# Altium project Accelerometer.PrjPcb
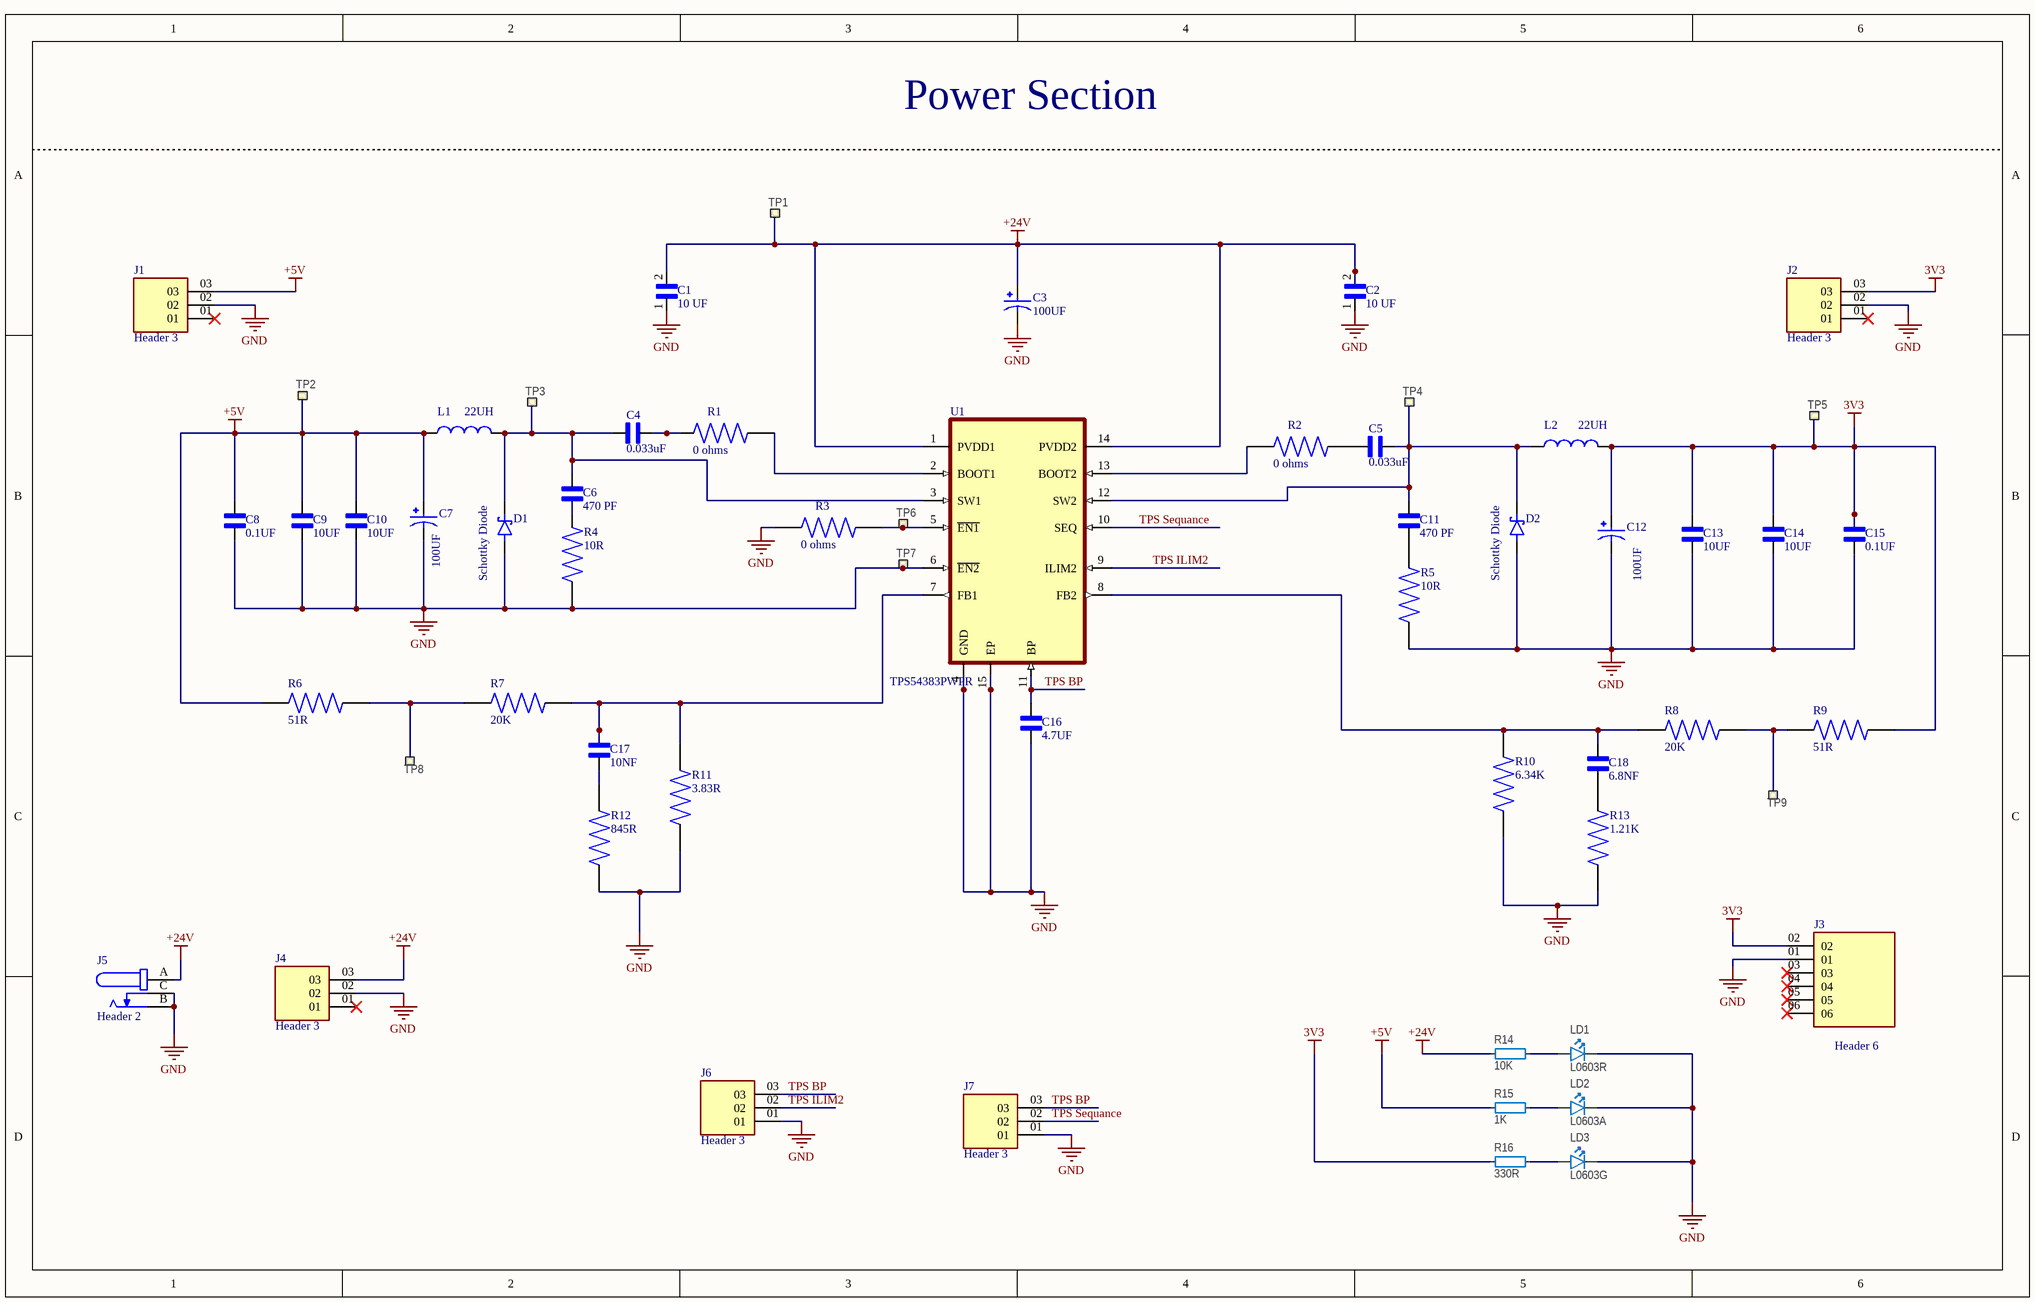
[diagram p0: Power section.SchDoc]
1 sheet, 58 parts. Net scope: global (net labels, ports and power ports of the same name join across sheets).
Board file: Accelero.PcbDoc

## Sheet Power section.SchDoc
size 381 x 241 mm; SheetNumber: 1; SheetTotal: 1

### Parts
C1  10 UF  [CAPC3216X180N]
C2  10 UF  [CAPC3216X180N]
C3  100UF  [CAP_EEEFC1E101P]
C4  0.033uF  [CAPC1608X90]
C5  0.033uF  [CAPC1608X90]
C6  470 PF  [CAPC1608X90]
C7  100UF  [CAP_EEEFC1E101P]
C8  0.1UF  [CAPC1608X90]
C9  10UF  [CAPC2012X140N]
C10  10UF  [CAPC2012X140N]
C11  470 PF  [CAPC1608X90]
C12  100UF  [CAP_EEEFC1E101P]
C13  10UF  [CAPC2012X140N]
C14  10UF  [CAPC2012X140N]
C15  0.1UF  [CAPC1608X90]
C16  4.7UF  [CAPC2012X140N]
C17  10NF  [CAPC1608X90]
C18  6.8NF  [CAPC1608X90]
D1  Schottky Diode  [DIOM7959X261N]
D2  Schottky Diode  [DIOM7959X261N]
J1  Header 3  [SAMTEC_HMTSW-103-XX-X-S-XXX]
J2  Header 3  [SAMTEC_HMTSW-103-XX-X-S-XXX]
J3  Header 6  [SAMTEC_MTLW-106-06-G-S-180]
J4  Header 3  [SAMTEC_HMTSW-103-XX-X-S-XXX]
J5  Header 2  [TENSILITY_54-00129]
J6  Header 3  [SAMTEC_HMTSW-103-XX-X-S-XXX]
J7  Header 3  [SAMTEC_HMTSW-103-XX-X-S-XXX]
L1  22UH  [IND_MSS1278-223MLB]
L2  22UH  [IND_MSS1278-223MLB]
LD1  L0603R  [LED_0603_R]
LD2  L0603A  [LED_0603_Y]
LD3  L0603G  [LED_0603_G]
R1  0 ohms  [RESC1608X55N]
R2  0 ohms  [RESC1608X55N]
R3  0 ohms  [RESC1608X55N]
R4  10R  [RESC1608X55N]
R5  10R  [RESC1608X55N]
R6  51R  [RESC1608X55N]
R7  20K  [RESC1608X55N]
R8  20K  [RESC1608X55N]
R9  51R  [RESC1608X55N]
R10  6.34K  [RESC1608X55N]
R11  3.83R  [RESC1608X55N]
R12  845R  [RESC1608X55N]
R13  1.21K  [RESC1608X55N]
R14  10K  [RESC0603X03L_C]
R15  1K  [RESC0603X03L_C]
R16  330R  [RESC0603X03L_C]
TP1  Ø0.7mm,SMD  [TP_SMD_D0.7mm]  (value not drawn)  (no BOM)
TP2  Ø0.7mm,SMD  [TP_SMD_D0.7mm]  (value not drawn)  (no BOM)
TP3  Ø0.7mm,SMD  [TP_SMD_D0.7mm]  (value not drawn)  (no BOM)
TP4  Ø0.7mm,SMD  [TP_SMD_D0.7mm]  (value not drawn)  (no BOM)
TP5  Ø0.7mm,SMD  [TP_SMD_D0.7mm]  (value not drawn)  (no BOM)
TP6  Ø0.7mm,SMD  [TP_SMD_D0.7mm]  (value not drawn)  (no BOM)
TP7  Ø0.7mm,SMD  [TP_SMD_D0.7mm]  (value not drawn)  (no BOM)
TP8  Ø0.7mm,SMD  [TP_SMD_D0.7mm]  (value not drawn)  (no BOM)
TP9  Ø0.7mm,SMD  [TP_SMD_D0.7mm]  (value not drawn)  (no BOM)
U1  TPS54383PWPR  [IC_TPS27S100BPWPR]

### Nets
3V3: C12.1 C13.1 C14.1 C15.1 J2.03 J3.02 L2.2 R9.1 R16.1 TP5.1
+5V: C7.1 C8.1 C9.1 C10.1 J1.03 L1.1 R6.2 R15.1 TP2.1
+24V: C1.2 C2.2 C3.1 J4.03 J5.A R14.1 TP1.1 U1.1(PVDD1) U1.14(PVDD2)
GND: C1.1 C2.1 C3.2 C7.2 C8.2 C9.2 C10.2 C12.2 C13.2 C14.2 C15.2 C16.2 D1.A D2.A J1.02 J2.02 J3.01 J4.02 J5.B J5.C J6.01 J7.01 LD1.1(C) LD2.1(C) LD3.1(C) R3.1 R4.1 R5.1 R10.1 R11.1 R12.1 R13.1 TP7.1 U1.4(GND) U1.6(~{EN2}) U1.15(EP)
TPS BP: C16.1 J6.03 J7.03 U1.11(BP)
TPS ILIM2: J6.02 U1.9(ILIM2)
TPS Sequance: J7.02 U1.10(SEQ)
NetC4_1: C4.1 R1.1
NetC4_2: C4.2 C6.1 D1.C(K) L1.2 TP3.1 U1.3(SW1)
NetC5_1: C5.1 C11.1 D2.C(K) L2.1 TP4.1 U1.12(SW2)
NetC5_2: C5.2 R2.2
NetC6_2: C6.2 R4.2
NetC11_2: C11.2 R5.2
NetC17_1: C17.1 R7.1 R11.2 U1.7(FB1)
NetC17_2: C17.2 R12.2
NetC18_1: C18.1 R8.2 R10.2 U1.8(FB2)
NetC18_2: C18.2 R13.2
NetLD1_2: LD1.2(A) R14.2
NetLD2_2: LD2.2(A) R15.2
NetLD3_2: LD3.2(A) R16.2
NetR1_2: R1.2 U1.2(BOOT1)
NetR2_1: R2.1 U1.13(BOOT2)
NetR3_2: R3.2 TP6.1 U1.5(~{EN1})
NetR6_1: R6.1 R7.2 TP8.1
NetR8_1: R8.1 R9.2 TP9.1

Not connected (* = marked no-connect by the designer): J1 01*; J2 01*; J3 03* 04* 05* 06*; J4 01*

### Notes on the sheet
- Power Section

### Library data of the parts
C1 C2 = C3216X5R1E106M160AB: CAP CER 10UF 16V X5R 1206; MF: TDK; Check_prices: https://www.snapeda.com/parts/C3216X5R1E106M160AB/TDK/view-part/?ref=eda; Value: *; Digi-Key_Part_Number: 445-7708-2-ND; MP: C3216X5R1E106M160AB; Package: 3216 TDK; Purchase-URL: https://pricing.snapeda.com/search/part/C3216X5R1E106M160AB/?ref=eda; SnapEDA_Link: https://www.snapeda.com/parts/C3216X5R1E106M160AB/TDK/view-part/?ref=snap
C3 = EEEFC1E101P: Capacitor, aluminum, 25 V, ±20%, 100 μF, 0.328 x 0.390 / inch; MF: Panasonic; MP: EEE-FC1E101P; SnapEDA_Link: https://www.snapeda.com/parts/EEE-FC1E101P/Panasonic+Electronic+Components/view-part/?ref=snap; Package: RADIAL-2 Panasonic; Value: *; Check_prices: https://www.snapeda.com/parts/EEE-FC1E101P/Panasonic+Electronic+Components/view-part/?ref=eda
C4 C5 = C0603C104J3RACTU: Capacitor, ceramic, 25 V, X7R, 20%, .033 μF, 0603; MF: KEMET; SnapEDA_Link: https://www.snapeda.com/parts/C0603C104J3RACTU/KEMET/view-part/?ref=snap; Package: 603-2 KEMET; Value: *; MP: C0603C104J3RACTU; Check_prices: https://www.snapeda.com/parts/C0603C104J3RACTU/KEMET/view-part/?ref=eda
C6 C11 = C0603C104J3RACTU: Capacitor, ceramic, 25 V, X7R, 20%, 470 pF, 0603; MF: KEMET; SnapEDA_Link: https://www.snapeda.com/parts/C0603C104J3RACTU/KEMET/view-part/?ref=snap; Package: 603-2 KEMET; Value: *; MP: C0603C104J3RACTU; Check_prices: https://www.snapeda.com/parts/C0603C104J3RACTU/KEMET/view-part/?ref=eda
C7 C12 = EEEFC1E101P: Capacitor, aluminum, 10 V, 20%, FC series, 100 μF, / 0.335 x 0.374; MF: Panasonic; MP: EEE-FC1E101P; SnapEDA_Link: https://www.snapeda.com/parts/EEE-FC1E101P/Panasonic+Electronic+Components/view-part/?ref=snap; Package: RADIAL-2 Panasonic; Value: *; Check_prices: https://www.snapeda.com/parts/EEE-FC1E101P/Panasonic+Electronic+Components/view-part/?ref=eda
C8 C15 = C0603C104J3RACTU: Capacitor, ceramic, 10 V, X7R, 20%, 0.1 μF, 0603; MF: KEMET; SnapEDA_Link: https://www.snapeda.com/parts/C0603C104J3RACTU/KEMET/view-part/?ref=snap; Package: 603-2 KEMET; Value: *; MP: C0603C104J3RACTU; Check_prices: https://www.snapeda.com/parts/C0603C104J3RACTU/KEMET/view-part/?ref=eda
C9 C10 C13 C14 = 0805ZD474MAT2A: Capacitor, ceramic, 6.3 V, X5R, 20%, 10 μF, 0805; MF: AVX; SnapEDA_Link: https://www.snapeda.com/parts/0805ZD474MAT2A/AVX/view-part/?ref=snap; Package: 0805-2 AVX; Value: *; MP: 0805ZD474MAT2A; Check_prices: https://www.snapeda.com/parts/0805ZD474MAT2A/AVX/view-part/?ref=eda
C16 = 0805ZD474MAT2A: Capacitor, ceramic, 10 V, X5R, 20%, 4.7 μF, 0805; MF: AVX; SnapEDA_Link: https://www.snapeda.com/parts/0805ZD474MAT2A/AVX/view-part/?ref=snap; Package: 0805-2 AVX; Value: *; MP: 0805ZD474MAT2A; Check_prices: https://www.snapeda.com/parts/0805ZD474MAT2A/AVX/view-part/?ref=eda
C17 = C0603C104J3RACTU: Capacitor, ceramic, 25 V, X7R, 20%, 10 nF, 0603; MF: KEMET; SnapEDA_Link: https://www.snapeda.com/parts/C0603C104J3RACTU/KEMET/view-part/?ref=snap; Package: 603-2 KEMET; Value: *; MP: C0603C104J3RACTU; Check_prices: https://www.snapeda.com/parts/C0603C104J3RACTU/KEMET/view-part/?ref=eda
C18 = C0603C104J3RACTU: Capacitor, ceramic, 25 V, X7R, 20%, 6.8 nF, 0603; MF: KEMET; SnapEDA_Link: https://www.snapeda.com/parts/C0603C104J3RACTU/KEMET/view-part/?ref=snap; Package: 603-2 KEMET; Value: *; MP: C0603C104J3RACTU; Check_prices: https://www.snapeda.com/parts/C0603C104J3RACTU/KEMET/view-part/?ref=eda
D1 D2 = MBRS330T3G: Diode Schottky 30 V 3A Surface Mount SMC; MF: ON Semiconductor; SnapEDA_Link: https://www.snapeda.com/parts/MBRS330T3G/Onsemi/view-part/?ref=snap; Package: SMC-2 ON Semiconductor; Value: *; MP: MBRS330T3G; Check_prices: https://www.snapeda.com/parts/MBRS330T3G/Onsemi/view-part/?ref=eda
J1 J2 J4 J6 J7 = HMTSW-103-XX-X-S-XXX: Connector Unshrouded Header 3 Position 2.54mm Solder Straight Through Hole; MF: Samtec; MP: HMTSW-103-10-T-S-330; SnapEDA_Link: https://www.snapeda.com/parts/HMTSW-103-10-T-S-330/Samtec/view-part/?ref=snap; Package: None; Value: *; Check_prices: https://www.snapeda.com/parts/HMTSW-103-10-T-S-330/Samtec/view-part/?ref=eda
J3 = MTLW-106-06-G-S-180: Package: None; MP: MTLW-106-06-G-S-180; Price: None; Availability: Unavailable; Value: *
J5 = 54-00129: Connector, dc jack 5.5x2.1 mm, PCB mount, 90 degrees, silver plated, thru hole; MF: Tensility International Corp; Package: None; Price: None; Check_prices: https://www.snapeda.com/parts/54-00129/Tensility+International+Corp/view-part/?ref=eda; Value: *; SnapEDA_Link: https://www.snapeda.com/parts/54-00129/Tensility+International+Corp/view-part/?ref=snap; MP: 54-00129; Availability: In Stock; Purchase-URL: https://pricing.snapeda.com/search?q=54-00129&ref=eda
L1 L2 = MSS1278-223MLB: Inductor, Power, 6.8 A, 0.038 Ω, 22 μH, 0.484 x 0.484 / inch; MF: Coilcraft; SnapEDA_Link: https://www.snapeda.com/parts/MSS1278-223MLB/Coilcraft/view-part/?ref=snap; Package: None; Value: *; MP: MSS1278-223MLB; Check_prices: https://www.snapeda.com/parts/MSS1278-223MLB/Coilcraft/view-part/?ref=eda
LD1 = ASMT-RR45-AQ902: LED, Red, 0603, Vf=2V, - 40 to +100°C; Manufacturer: Avago; Part number NEMS: 101400008; Component Status: Active; Pad Count: 2; Note: 90 mcd @ 20 mA; Artikkelnr Noca: N.A.; Part Number: ASMT-RR45-AQ902; PartId: 101400008; Component Class: Optoelectronics; Author: rsk; Manufacturer Part Number: ASMT-RR45-AQ902; ComponentLink1URL: N.A.; ComponentLink1Description: Datasheet; ComponentLink2URL: N.A.; ComponentLink2Description: Supplier link; HelpURL: http://www.avagotech.com/docs/AV02-0378EN; LatestRevisionDate: 2015-06-12; Published: 2015-06-12; Footprint Doc: 0603; Value: L0603R; Supplier 1: Digi-Key; Supplier Part Number 1: 516-2005-1-ND; Supplier 2: Mouser; Supplier Part Number 2: 630-ASMT-RR45-AQ902; Part number IPS: N.A.; Part number Norautron: N.A.
LD2 = ASMT-RA45-AP932: LED, Amber, 0603,  Vf=2V, - 40 to +100°C; Manufacturer: Avago; Part number NEMS: 101400011; Component Status: Active; Pad Count: 2; Note: 57 mcd @ 20 mA; Artikkelnr Noca: N.A.; Part Number: ASMT-RA45-AP932; PartId: 101400011; Component Class: Optoelectronics; Author: rsk; Manufacturer Part Number: ASMT-RA45-AP932; ComponentLink1URL: N.A.; ComponentLink1Description: Datasheet; ComponentLink2URL: N.A.; ComponentLink2Description: Supplier link; HelpURL: http://www.avagotech.com/docs/AV02-0378EN; LatestRevisionDate: 2015-06-12; Published: 2015-06-12; Footprint Doc: 0603; Value: L0603A; Supplier 1: N.A.; Supplier Part Number 1: N.A.; Supplier 2: Mouser; Supplier Part Number 2: 630-ASMT-RA45-AP932; Part number IPS: N.A.; Part number Norautron: N.A.
LD3 = ASMT-RF45-AN002: LED, Yellow Green, 0603, Vf=2V, - 40 to +100°C; Manufacturer: Avago; Part number NEMS: 101400010; Component Status: Active; Pad Count: 2; Note: 28 mcd @ 20 mA; Artikkelnr Noca: N.A.; Part Number: ASMT-RF45-AN002; PartId: 101400010; Component Class: Optoelectronics; Author: rsk; Manufacturer Part Number: ASMT-RF45-AN002; ComponentLink1URL: N.A.; ComponentLink1Description: Datasheet; ComponentLink2URL: N.A.; ComponentLink2Description: Supplier link; HelpURL: http://www.avagotech.com/docs/AV02-0378EN; LatestRevisionDate: 2015-06-12; Published: 2015-06-12; Footprint Doc: 0603; Value: L0603G; Supplier 1: Digi-Key; Supplier Part Number 1: 516-2522-1-ND; Supplier 2: Mouser; Supplier Part Number 2: 630-ASMT-RF45-AN002; Part number IPS: N.A.; Part number Norautron: N.A.
R1-R3 = RC0603JR-0751RL: Resistor, chip, 1/16 W, 5%, 0 Ω, 0603; MF: Yageo; SnapEDA_Link: https://www.snapeda.com/parts/RC0603JR-0751RL/Yageo/view-part/?ref=snap; Package: 1608 Yageo; Value: *; MP: RC0603JR-0751RL; Check_prices: https://www.snapeda.com/parts/RC0603JR-0751RL/Yageo/view-part/?ref=eda
R4 R5 = RC0603JR-0751RL: Resistor, chip, 1/16 W, 5%, 10 Ω, 0603; MF: Yageo; SnapEDA_Link: https://www.snapeda.com/parts/RC0603JR-0751RL/Yageo/view-part/?ref=snap; Package: 1608 Yageo; Value: *; MP: RC0603JR-0751RL; Check_prices: https://www.snapeda.com/parts/RC0603JR-0751RL/Yageo/view-part/?ref=eda
R6 R9 = RC0603JR-0751RL: Resistor, chip, 1/16 W, 5%, 51 Ω, 0603; MF: Yageo; SnapEDA_Link: https://www.snapeda.com/parts/RC0603JR-0751RL/Yageo/view-part/?ref=snap; Package: 1608 Yageo; Value: *; MP: RC0603JR-0751RL; Check_prices: https://www.snapeda.com/parts/RC0603JR-0751RL/Yageo/view-part/?ref=eda
R7 R8 = RC0603JR-0751RL: Resistor, chip, 1/16 W, 1%, 20 kΩ, 0603; MF: Yageo; SnapEDA_Link: https://www.snapeda.com/parts/RC0603JR-0751RL/Yageo/view-part/?ref=snap; Package: 1608 Yageo; Value: *; MP: RC0603JR-0751RL; Check_prices: https://www.snapeda.com/parts/RC0603JR-0751RL/Yageo/view-part/?ref=eda
R10 = RC0603JR-0751RL: Resistor, chip, 1/16 W, 1%, 6.34 kΩ, 0603; MF: Yageo; SnapEDA_Link: https://www.snapeda.com/parts/RC0603JR-0751RL/Yageo/view-part/?ref=snap; Package: 1608 Yageo; Value: *; MP: RC0603JR-0751RL; Check_prices: https://www.snapeda.com/parts/RC0603JR-0751RL/Yageo/view-part/?ref=eda
R11 = RC0603JR-0751RL: Resistor, chip, 1/16 W, 1%, 3.83 kΩ, 0603; MF: Yageo; SnapEDA_Link: https://www.snapeda.com/parts/RC0603JR-0751RL/Yageo/view-part/?ref=snap; Package: 1608 Yageo; Value: *; MP: RC0603JR-0751RL; Check_prices: https://www.snapeda.com/parts/RC0603JR-0751RL/Yageo/view-part/?ref=eda
R12 = RC0603JR-0751RL: Resistor, chip, 1/16 W, 1%, 845 Ω, 0603; MF: Yageo; SnapEDA_Link: https://www.snapeda.com/parts/RC0603JR-0751RL/Yageo/view-part/?ref=snap; Package: 1608 Yageo; Value: *; MP: RC0603JR-0751RL; Check_prices: https://www.snapeda.com/parts/RC0603JR-0751RL/Yageo/view-part/?ref=eda
R13 = RC0603JR-0751RL: Resistor, chip, 1/16 W, 1%, 1.21 kΩ, 0603; MF: Yageo; SnapEDA_Link: https://www.snapeda.com/parts/RC0603JR-0751RL/Yageo/view-part/?ref=snap; Package: 1608 Yageo; Value: *; MP: RC0603JR-0751RL; Check_prices: https://www.snapeda.com/parts/RC0603JR-0751RL/Yageo/view-part/?ref=eda
R14 R16 = R0201-1k0: Resistor, ±1%, 0.05W; Manufacturer: N.A.; Part number IPS: 00000005786; Part number NEMS: 100100043; Component Status: Active; Pad Count: 2; Value: 1k; Note: Chip Res 1%; Part Number: R0201-1k0; PartId: 100100043; Component Class: Resistors; Author: rsk; Manufacturer Part Number: N.A.; ComponentLink1URL: N.A.; ComponentLink1Description: Datasheet; ComponentLink2URL: N.A.; ComponentLink2Description: Supplier link; HelpURL: N.A.; LatestRevisionDate: 2014-11-13; Published: 2014-11-13; Footprint Doc: 0201; Supplier 1: N.A.; Supplier Part Number 1: N.A.; Supplier 2: N.A.; Supplier Part Number 2: N.A.; Artikkelnr Noca: N.A.; Part number Norautron: N.A.
R15 = R0201-1k0: Resistor, ±1%, 0.05W; Manufacturer: N.A.; Part number IPS: 00000005786; Part number NEMS: 100100043; Component Status: Active; Pad Count: 2; Note: Chip Res 1%; Part Number: R0201-1k0; PartId: 100100043; Component Class: Resistors; Author: rsk; Manufacturer Part Number: N.A.; ComponentLink1URL: N.A.; ComponentLink1Description: Datasheet; ComponentLink2URL: N.A.; ComponentLink2Description: Supplier link; HelpURL: N.A.; LatestRevisionDate: 2014-11-13; Published: 2014-11-13; Footprint Doc: 0201; Value: 1k; Supplier 1: N.A.; Supplier Part Number 1: N.A.; Supplier 2: N.A.; Supplier Part Number 2: N.A.; Artikkelnr Noca: N.A.; Part number Norautron: N.A.
TP1-TP9 = TP_SMD_Ø0.7MM: 0.7mm circular SMD testpad; Manufacturer: Nordic Semiconductor; Manufacturer Part Number: N.A.; Part number NEMS: 100500474; Component Status: Active; Pad Count: 1; System: Connector; Part Number: TP_SMD_Ø0.7MM; PartId: 100500474; Component Class: Connectors; Author: rsk; ComponentLink1URL: N.A.; ComponentLink1Description: Datasheet; ComponentLink2URL: N.A.; ComponentLink2Description: Supplier link; HelpURL: N.A.; LatestRevisionDate: 2021-03-05; Published: 2017-12-14; Footprint Doc: TP_SMD_Ø0.7mm; Value: Ø0.7mm,SMD; Note: N.A.; Supplier 1: N.A.; Supplier Part Number 1: N.A.; Supplier 2: N.A.; Supplier Part Number 2: N.A.; Artikkelnr Noca: N.A.; Part number IPS: N.A.; Part number Norautron: N.A.
U1 = TPS54383PWPR: MF: {'manufacturer': u'Texas Instruments'}; Package: None; Price: None; Value: *; MP: TPS54383PWPR; Availability: Unavailable